# EAGLE schematic controllo motori - encoder_r1 (EAGLE 6.5.0)
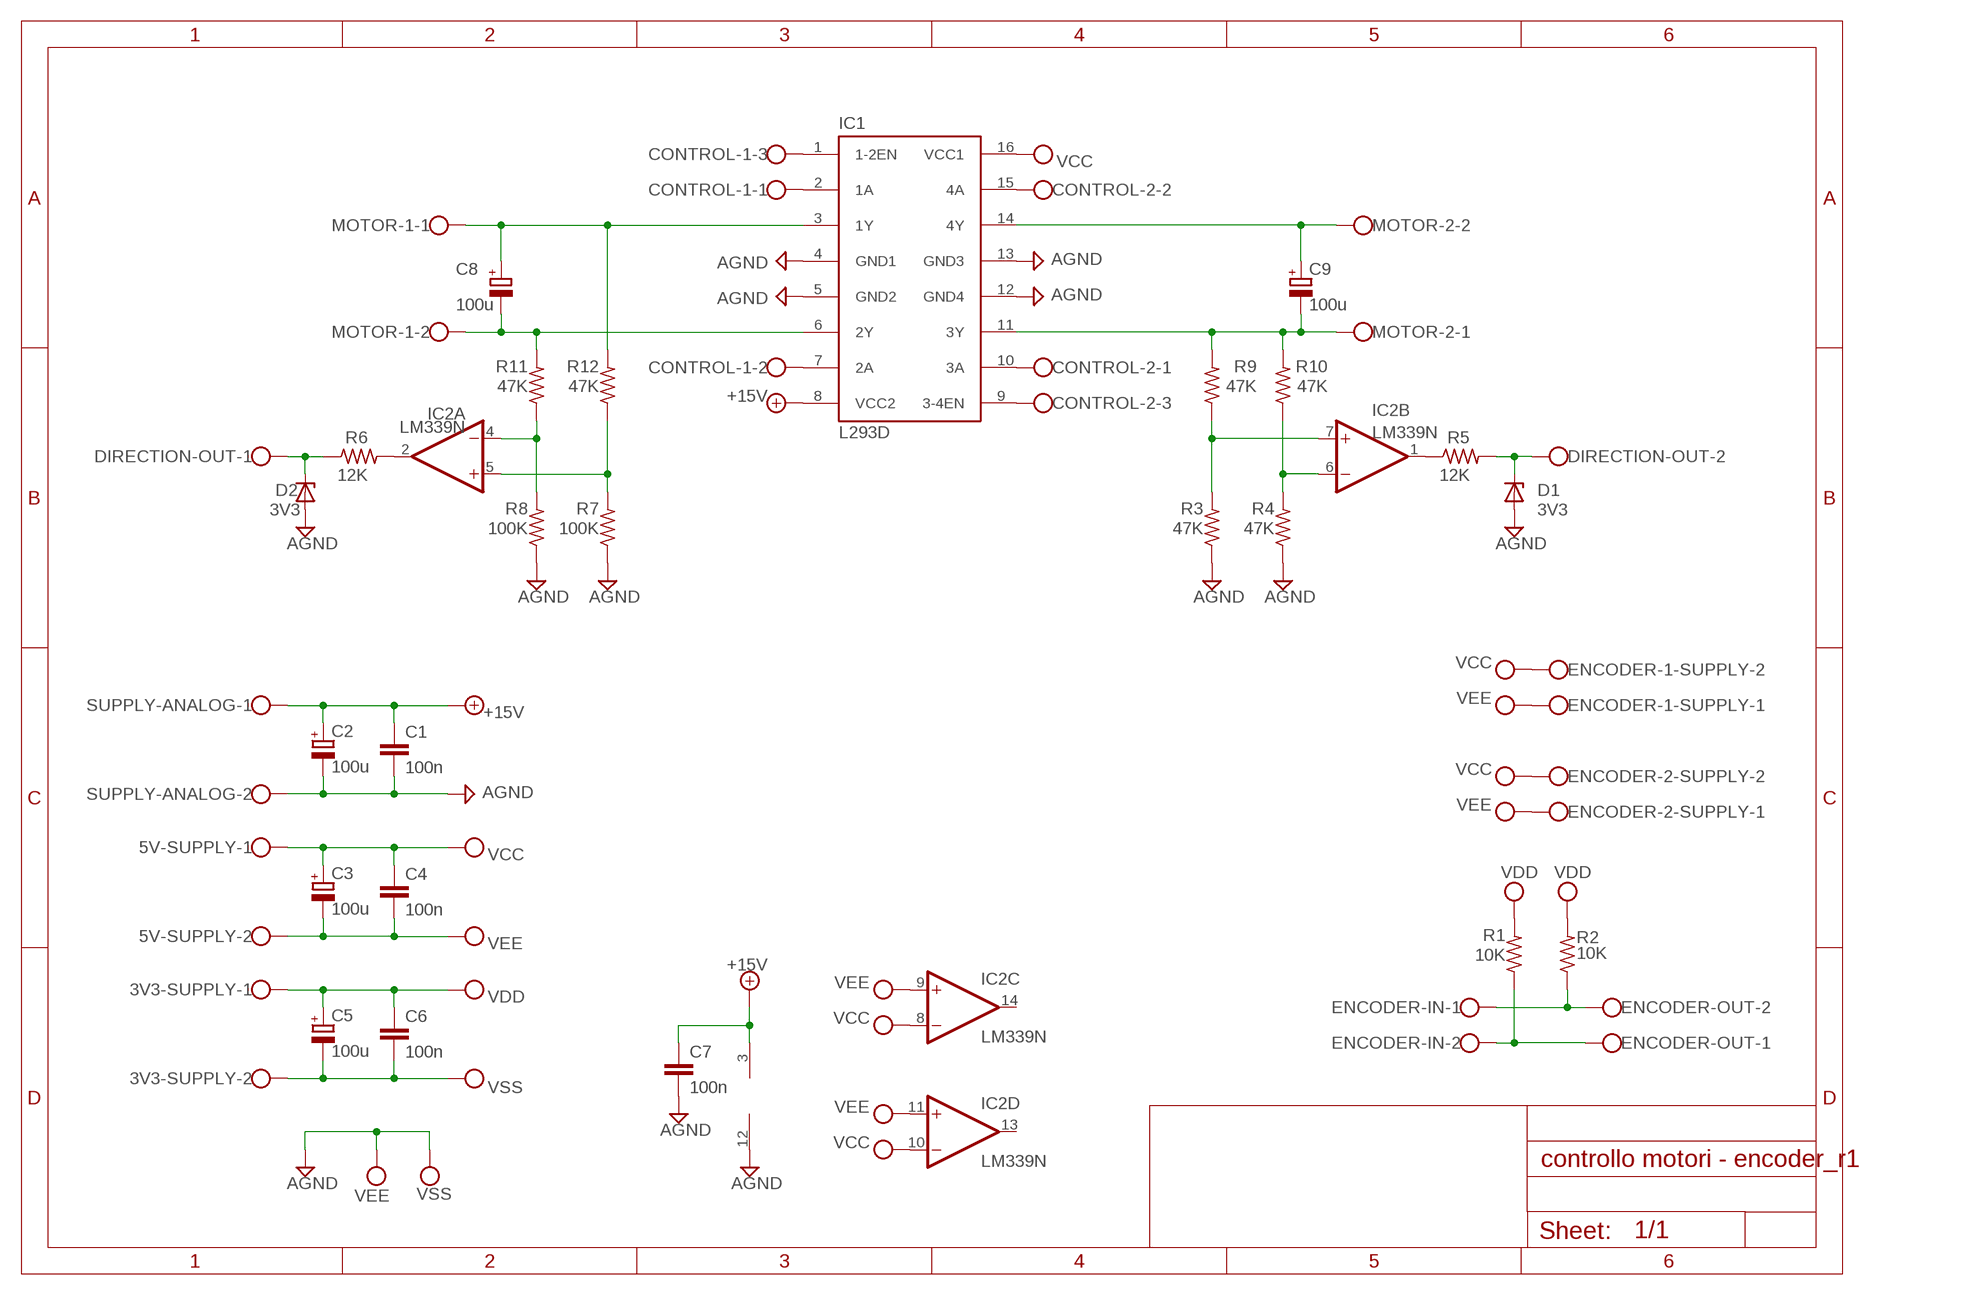
[diagram p0: schematic, sheet 1]

## Parts
3V3-SUPPLY  W237-102  [W237-102]
5V-SUPPLY  W237-102  [W237-102]
C1  100n  C-EU025-025X050  [C025-025X050]
C2  100u  CPOL-EUB45181B  [B45181B]
C3  100u  CPOL-EUB45181B  [B45181B]
C4  100n  C-EU025-025X050  [C025-025X050]
C5  100u  CPOL-EUB45181B  [B45181B]
C6  100n  C-EU025-025X050  [C025-025X050]
C7  100n  C-EU025-025X050  [C025-025X050]
C8  100u  CPOL-EUB45181B  [B45181B]
C9  100u  CPOL-EUB45181B  [B45181B]
CONTROL-1  W237-103  [W237-103]
CONTROL-2  W237-103  [W237-103]
D1  3V3  ZENER-DIODEC1702-15  [C1702-15]
D2  3V3  ZENER-DIODEC1702-15  [C1702-15]
DIRECTION-OUT  W237-102  [W237-102]
ENCODER-1-SUPPLY  W237-102  [W237-102]
ENCODER-2-SUPPLY  W237-102  [W237-102]
ENCODER-IN  W237-102  [W237-102]
ENCODER-OUT  W237-102  [W237-102]
IC1  L293D  [DIL16]
IC2  LM339N  [DIL14]
MOTOR-1  W237-102  [W237-102]
MOTOR-2  W237-102  [W237-102]
R1  10K  R-US_0204/7  [0204/7]
R2  10K  R-US_0204/7  [0204/7]
R3  47K  R-US_0204/7  [0204/7]
R4  47K  R-US_0204/7  [0204/7]
R5  12K  R-US_0204/7  [0204/7]
R6  12K  R-US_0204/7  [0204/7]
R7  100K  R-US_0204/7  [0204/7]
R8  100K  R-US_0204/7  [0204/7]
R9  47K  R-US_0204/7  [0204/7]
R10  47K  R-US_0204/7  [0204/7]
R11  47K  R-US_0204/7  [0204/7]
R12  47K  R-US_0204/7  [0204/7]
SUPPLY-ANALOG  W237-102  [W237-102]

## Nets
+15V: C1.1 C2.+ C7.1 IC1.8(VCC2) IC2.3(P:V+) SUPPLY-ANALOG.1
AGND: C1.2 C2.- C7.2 D1.A D2.A IC1.4(GND1) IC1.5(GND2) IC1.12(GND4) IC1.13(GND3) IC2.12(P:GND) R3.1 R4.1 R7.1 R8.1 SUPPLY-ANALOG.2
N$1: C8.+ IC1.3(1Y) MOTOR-1.1 R12.2
N$2: C8.- IC1.6(2Y) MOTOR-1.2 R11.2
N$3: C9.- IC1.11(3Y) MOTOR-2.1 R9.2 R10.2
N$4: C9.+ IC1.14(4Y) MOTOR-2.2
N$5: CONTROL-1.1 IC1.2(1A)
N$6: CONTROL-1.2 IC1.7(2A)
N$7: CONTROL-1.3 IC1.1(1-2EN)
N$8: CONTROL-2.3 IC1.9(3-4EN)
N$9: CONTROL-2.1 IC1.10(3A)
N$10: CONTROL-2.2 IC1.15(4A)
N$11: ENCODER-IN.2 ENCODER-OUT.1 R1.1
N$12: ENCODER-IN.1 ENCODER-OUT.2 R2.1
N$13: IC2.1(B:OUT) R5.1
N$14: D1.C DIRECTION-OUT.2 R5.2
N$15: IC2.2(A:OUT) R6.2
N$16: D2.C DIRECTION-OUT.1 R6.1
N$17: IC2.7(B:+IN) R3.2 R9.1
N$18: IC2.6(B:-IN) R4.2 R10.1
N$19: IC2.4(A:-IN) R8.2 R11.1
N$20: IC2.5(A:+IN) R7.2 R12.1
VCC: 5V-SUPPLY.1 C3.+ C4.1 ENCODER-1-SUPPLY.2 ENCODER-2-SUPPLY.2 IC1.16(VCC1) IC2.8(C:-IN) IC2.10(D:-IN)
VDD: 3V3-SUPPLY.1 C5.+ C6.1 R1.2 R2.2
VEE: 5V-SUPPLY.2 C3.- C4.2 ENCODER-1-SUPPLY.1 ENCODER-2-SUPPLY.1 IC2.9(C:+IN) IC2.11(D:+IN) ; supply symbol labelled VSS, AGND
VSS: 3V3-SUPPLY.2 C5.- C6.2
Unconnected: IC2.13(D:OUT) IC2.14(C:OUT)

## Library data of the parts
3V3-SUPPLY 5V-SUPPLY DIRECTION-OUT ENCODER-1-SUPPLY ENCODER-2-SUPPLY ENCODER-IN ENCODER-OUT MOTOR-1 MOTOR-2 SUPPLY-ANALOG = con-wago-500:W237-102: WAGO SCREW CLAMP; MPN: 237-102; OC_FARNELL: unknown; OC_NEWARK: 70K9898
C1 C4 C6 C7 = rcl:C-EU: CAPACITOR, European symbol
C2 C3 C5 C8 C9 = rcl:CPOL-EU: POLARIZED CAPACITOR, European symbol
CONTROL-1 CONTROL-2 = con-wago-500:W237-103: WAGO SCREW CLAMP; MPN: 237-103; OC_FARNELL: unknown; OC_NEWARK: 18M7116
D1 D2 = diode:ZENER-DIODE: Z-Diode
IC1 = st-microelectronics:L293D: PUSH-PULL 4 CHANNEL DRIVER; MPN: L293D; OC_FARNELL: 9589619; OC_NEWARK: 56P8249
IC2 = linear:LM339: Low Power Low Offset Voltage Quad Comparators with open collector; LM139/LM239/LM339/LM2901/LM3302
R1-R12 = rcl:R-US_: RESISTOR, American symbol